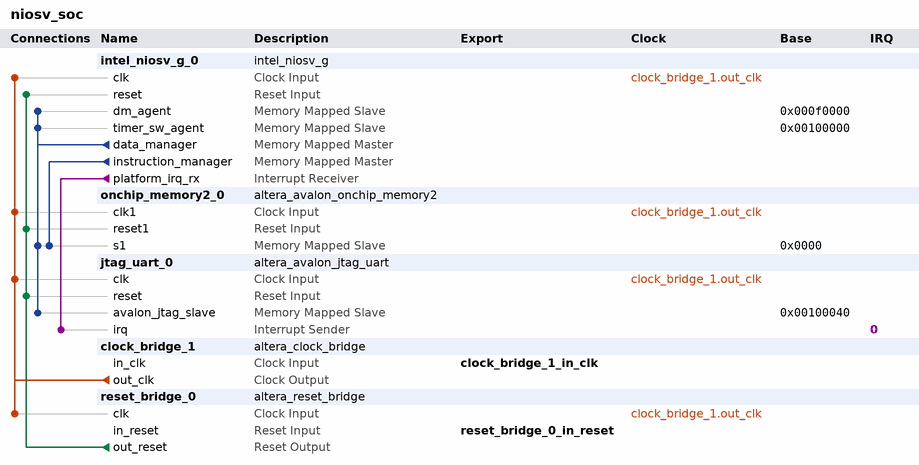
[diagram p0: system contents]
# Platform Designer (Qsys) system niosv_soc, Cyclone V 5CSXFC6D6F31C6
# Parameters at their usual value, and those the tool derives, are not listed.
package require -exact qsys 25.1
create_system niosv_soc
set_project_property DEVICE_FAMILY {Cyclone V}
set_project_property DEVICE 5CSXFC6D6F31C6

add_instance intel_niosv_g_0 intel_niosv_g 4.0.0
set_instance_parameter_value intel_niosv_g_0 Blind_Window_Period 1000
set_instance_parameter_value intel_niosv_g_0 CLICenabledInterruptMode 0
set_instance_parameter_value intel_niosv_g_0 CLICenabledShadowRegisterFiles 1
set_instance_parameter_value intel_niosv_g_0 Default_Timeout_Period 255
set_instance_parameter_value intel_niosv_g_0 alignCLICVectorTable 8
set_instance_parameter_value intel_niosv_g_0 basicInterruptMode 0
set_instance_parameter_value intel_niosv_g_0 basicShadowRegisterFiles 0
set_instance_parameter_value intel_niosv_g_0 clockFrequency 50000000
set_instance_parameter_value intel_niosv_g_0 dataCacheSize 1024
set_instance_parameter_value intel_niosv_g_0 disableFsqrtFdiv false
set_instance_parameter_value intel_niosv_g_0 dtcm1Base 0
set_instance_parameter_value intel_niosv_g_0 dtcm1Size 0
set_instance_parameter_value intel_niosv_g_0 dtcm2Base 0
set_instance_parameter_value intel_niosv_g_0 dtcm2Size 0
set_instance_parameter_value intel_niosv_g_0 enableBranchPrediction true
set_instance_parameter_value intel_niosv_g_0 enableCLICInterruptEdgeTriggerConfig false
set_instance_parameter_value intel_niosv_g_0 enableCLICInterruptPolarityConfig false
set_instance_parameter_value intel_niosv_g_0 enableCLICSelectiveHardwareVectoring false
set_instance_parameter_value intel_niosv_g_0 enableCoreLevelInterruptController false
set_instance_parameter_value intel_niosv_g_0 enableDebug true
set_instance_parameter_value intel_niosv_g_0 enableDebugReset false
set_instance_parameter_value intel_niosv_g_0 enableECCFull false
set_instance_parameter_value intel_niosv_g_0 enableECCLite false
set_instance_parameter_value intel_niosv_g_0 enableFPU false
set_instance_parameter_value intel_niosv_g_0 enableLockstep false
set_instance_parameter_value intel_niosv_g_0 enableLockstepExtRst false
set_instance_parameter_value intel_niosv_g_0 enableMulDiv true
set_instance_parameter_value intel_niosv_g_0 hartId 0
set_instance_parameter_value intel_niosv_g_0 instCacheSize 1024
set_instance_parameter_value intel_niosv_g_0 itcm1Base 0
set_instance_parameter_value intel_niosv_g_0 itcm1Size 0
set_instance_parameter_value intel_niosv_g_0 itcm2Base 0
set_instance_parameter_value intel_niosv_g_0 itcm2Size 0
set_instance_parameter_value intel_niosv_g_0 numCLICDebugTriggers 0
set_instance_parameter_value intel_niosv_g_0 numCLICLevels 2
set_instance_parameter_value intel_niosv_g_0 numCLICPlatformInterrupts 16
set_instance_parameter_value intel_niosv_g_0 numCLICPriorities 8
set_instance_parameter_value intel_niosv_g_0 peripheralRegionABase 983040
set_instance_parameter_value intel_niosv_g_0 peripheralRegionASize 4096
set_instance_parameter_value intel_niosv_g_0 peripheralRegionBBase 0
set_instance_parameter_value intel_niosv_g_0 peripheralRegionBSize 0
set_instance_parameter_value intel_niosv_g_0 resetOffset 0
set_instance_parameter_value intel_niosv_g_0 resetSlave Absolute
set_instance_parameter_value intel_niosv_g_0 useResetReq false

add_instance onchip_memory2_0 altera_avalon_onchip_memory2 25.1
set_instance_parameter_value onchip_memory2_0 dataWidth 32
set_instance_parameter_value onchip_memory2_0 dualPort false
set_instance_parameter_value onchip_memory2_0 initMemContent true
set_instance_parameter_value onchip_memory2_0 initializationFileName onchip_mem.hex
set_instance_parameter_value onchip_memory2_0 memorySize 131072
set_instance_parameter_value onchip_memory2_0 singleClockOperation true

add_instance jtag_uart_0 altera_avalon_jtag_uart 25.1
set_instance_parameter_value jtag_uart_0 simInteractiveOptions NO_INTERACTIVE_WINDOWS

add_instance clock_bridge_1 altera_clock_bridge 25.1
set_instance_parameter_value clock_bridge_1 DERIVED_CLOCK_RATE 0
set_instance_parameter_value clock_bridge_1 EXPLICIT_CLOCK_RATE 50000000

add_instance reset_bridge_0 altera_reset_bridge 25.1
set_instance_parameter_value reset_bridge_0 ACTIVE_LOW_RESET 0
set_instance_parameter_value reset_bridge_0 SYNCHRONOUS_EDGES deassert

# connections
add_connection clock_bridge_1.out_clk intel_niosv_g_0.clk clock
add_connection clock_bridge_1.out_clk jtag_uart_0.clk clock
add_connection clock_bridge_1.out_clk onchip_memory2_0.clk1 clock
add_connection clock_bridge_1.out_clk reset_bridge_0.clk clock
add_connection reset_bridge_0.out_reset intel_niosv_g_0.reset reset
add_connection reset_bridge_0.out_reset jtag_uart_0.reset reset
add_connection reset_bridge_0.out_reset onchip_memory2_0.reset1 reset
add_connection intel_niosv_g_0.data_manager intel_niosv_g_0.dm_agent avalon
set_connection_parameter_value intel_niosv_g_0.data_manager/intel_niosv_g_0.dm_agent baseAddress 0x000f0000
add_connection intel_niosv_g_0.data_manager intel_niosv_g_0.timer_sw_agent avalon
set_connection_parameter_value intel_niosv_g_0.data_manager/intel_niosv_g_0.timer_sw_agent baseAddress 0x00100000
add_connection intel_niosv_g_0.data_manager jtag_uart_0.avalon_jtag_slave avalon
set_connection_parameter_value intel_niosv_g_0.data_manager/jtag_uart_0.avalon_jtag_slave baseAddress 0x00100040
add_connection intel_niosv_g_0.data_manager onchip_memory2_0.s1 avalon
set_connection_parameter_value intel_niosv_g_0.data_manager/onchip_memory2_0.s1 baseAddress 0x0000
add_connection intel_niosv_g_0.instruction_manager onchip_memory2_0.s1 avalon
set_connection_parameter_value intel_niosv_g_0.instruction_manager/onchip_memory2_0.s1 baseAddress 0x0000
add_connection intel_niosv_g_0.platform_irq_rx jtag_uart_0.irq interrupt
set_connection_parameter_value intel_niosv_g_0.platform_irq_rx/jtag_uart_0.irq irqNumber 0

# exported interfaces
add_interface clock_bridge_1_in_clk clock sink
set_interface_property clock_bridge_1_in_clk EXPORT_OF clock_bridge_1.in_clk
add_interface reset_bridge_0_in_reset reset sink
set_interface_property reset_bridge_0_in_reset EXPORT_OF reset_bridge_0.in_reset

set_interconnect_requirement {$system} qsys_mm.clockCrossingAdapter HANDSHAKE
set_interconnect_requirement {$system} qsys_mm.enableEccProtection FALSE
set_interconnect_requirement {$system} qsys_mm.insertDefaultSlave FALSE
set_interconnect_requirement {$system} qsys_mm.maxAdditionalLatency 1

save_system niosv_soc.qsys
